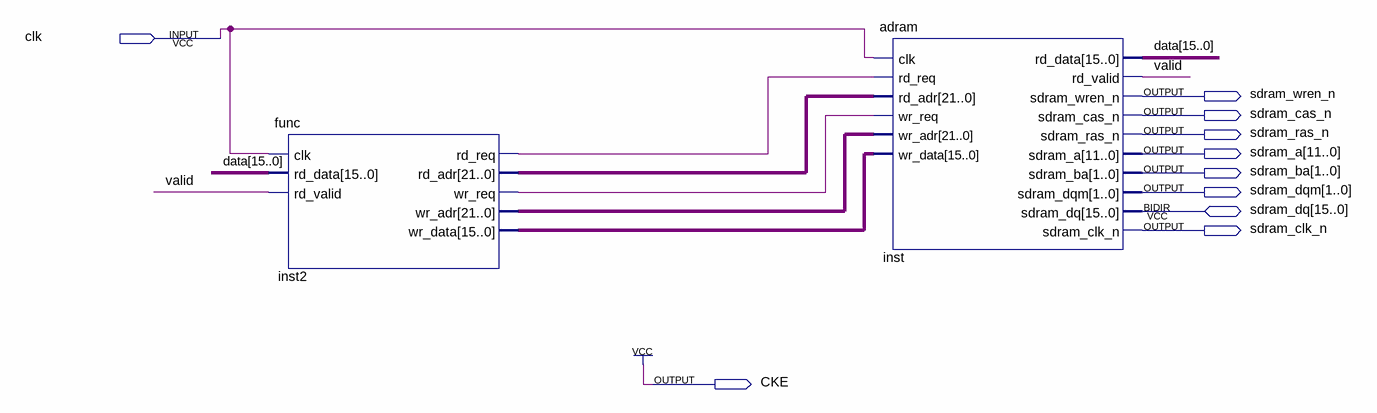
[diagram p0: schematic sheet]
// Quartus schematic Block1.bdf as structural Verilog: 2 symbols, 10 pins
module Block1 (
  input  clk,
  inout  [15:0] sdram_dq,
  output sdram_wren_n,
  output sdram_cas_n,
  output sdram_ras_n,
  output [11:0] sdram_a,
  output [1:0] sdram_ba,
  output [1:0] sdram_dqm,
  output sdram_clk_n,
  output CKE
);

  wire inst2_rd_req, inst2_wr_req, valid;
  wire [15:0] data, inst2_wr_data;
  wire [21:0] inst2_rd_adr, inst2_wr_adr;

  func inst2 (
    .clk(clk), .rd_data(data), .rd_valid(valid), .rd_req(inst2_rd_req), .rd_adr(inst2_rd_adr),
    .wr_req(inst2_wr_req), .wr_adr(inst2_wr_adr), .wr_data(inst2_wr_data));
  adram inst (
    .clk(clk), .rd_req(inst2_rd_req), .rd_adr(inst2_rd_adr), .wr_req(inst2_wr_req), .wr_adr(inst2_wr_adr),
    .wr_data(inst2_wr_data), .rd_data(data), .rd_valid(valid), .sdram_wren_n(sdram_wren_n),
    .sdram_cas_n(sdram_cas_n), .sdram_ras_n(sdram_ras_n), .sdram_a(sdram_a), .sdram_ba(sdram_ba),
    .sdram_dqm(sdram_dqm), .sdram_clk_n(sdram_clk_n), .sdram_dq(sdram_dq));

  assign CKE = 1'b1;
endmodule
